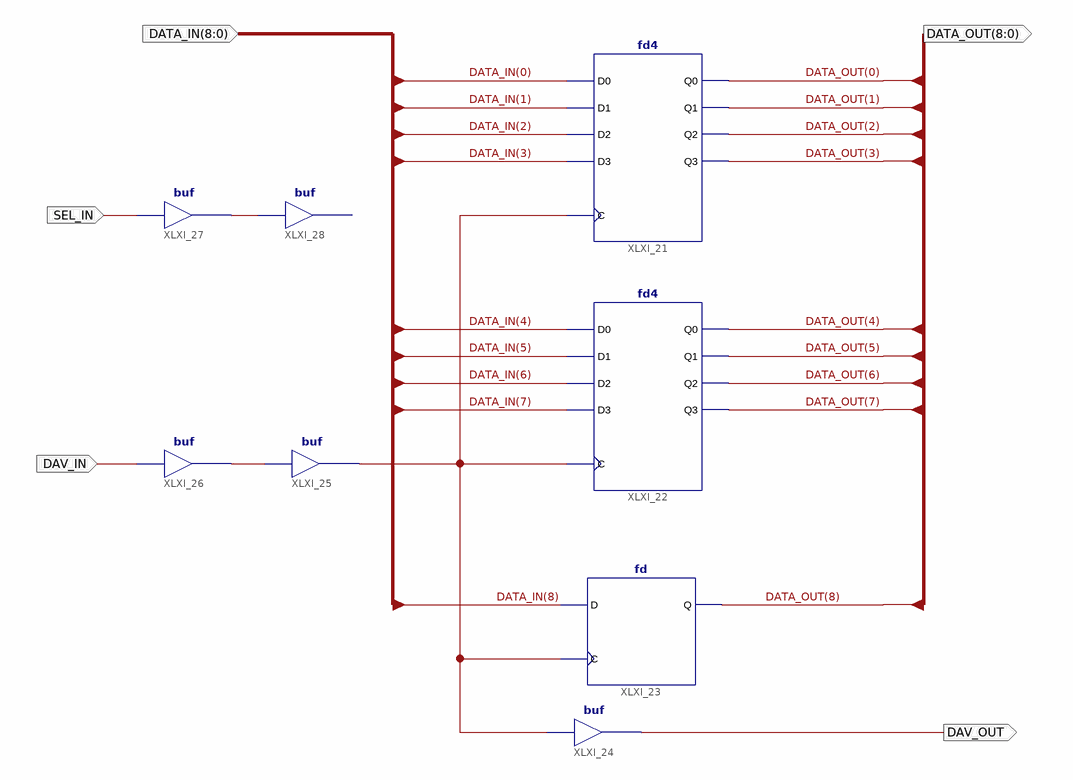
[diagram p0: schematic sheet 1]
// Xilinx ISE schematic Output_buffer.sch (xbr) as structural Verilog: 8 symbols, 5 ports
module Output_buffer (
  input  [8:0] DATA_IN,
  input  SEL_IN,
  input  DAV_IN,
  output DAV_OUT,
  output [8:0] DATA_OUT
);

  wire XLXN_37, XLXN_40, XLXN_53;

  buf XLXI_24 (DAV_OUT, XLXN_53);
  fd XLXI_23 (.C(XLXN_53), .D(DATA_IN[8]), .Q(DATA_OUT[8]));
  fd4 XLXI_22 (
    .C(XLXN_53), .D0(DATA_IN[4]), .D1(DATA_IN[5]), .D2(DATA_IN[6]), .D3(DATA_IN[7]), .Q0(DATA_OUT[4]),
    .Q1(DATA_OUT[5]), .Q2(DATA_OUT[6]), .Q3(DATA_OUT[7]));
  fd4 XLXI_21 (
    .C(XLXN_53), .D0(DATA_IN[0]), .D1(DATA_IN[1]), .D2(DATA_IN[2]), .D3(DATA_IN[3]), .Q0(DATA_OUT[0]),
    .Q1(DATA_OUT[1]), .Q2(DATA_OUT[2]), .Q3(DATA_OUT[3]));
  buf XLXI_27 (XLXN_40, SEL_IN);
  // buf XLXI_28 has open pins: I=XLXN_40, O=open
  buf XLXI_25 (XLXN_53, XLXN_37);
  buf XLXI_26 (XLXN_37, DAV_IN);
endmodule
